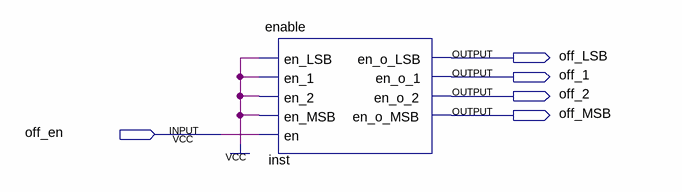
[diagram p0: schematic sheet]
// Quartus schematic off_en.bdf as structural Verilog: 1 symbols, 5 pins
module off_en (
  input  off_en,
  output off_LSB,
  output off_1,
  output off_2,
  output off_MSB
);

  enable inst (
    .en_LSB(1'b1), .en_1(1'b1), .en_2(1'b1), .en_MSB(1'b1), .en(off_en), .en_o_LSB(off_LSB), .en_o_1(off_1),
    .en_o_2(off_2), .en_o_MSB(off_MSB));
endmodule
